# EAGLE design v5_compact (EAGLE 7.7.0)
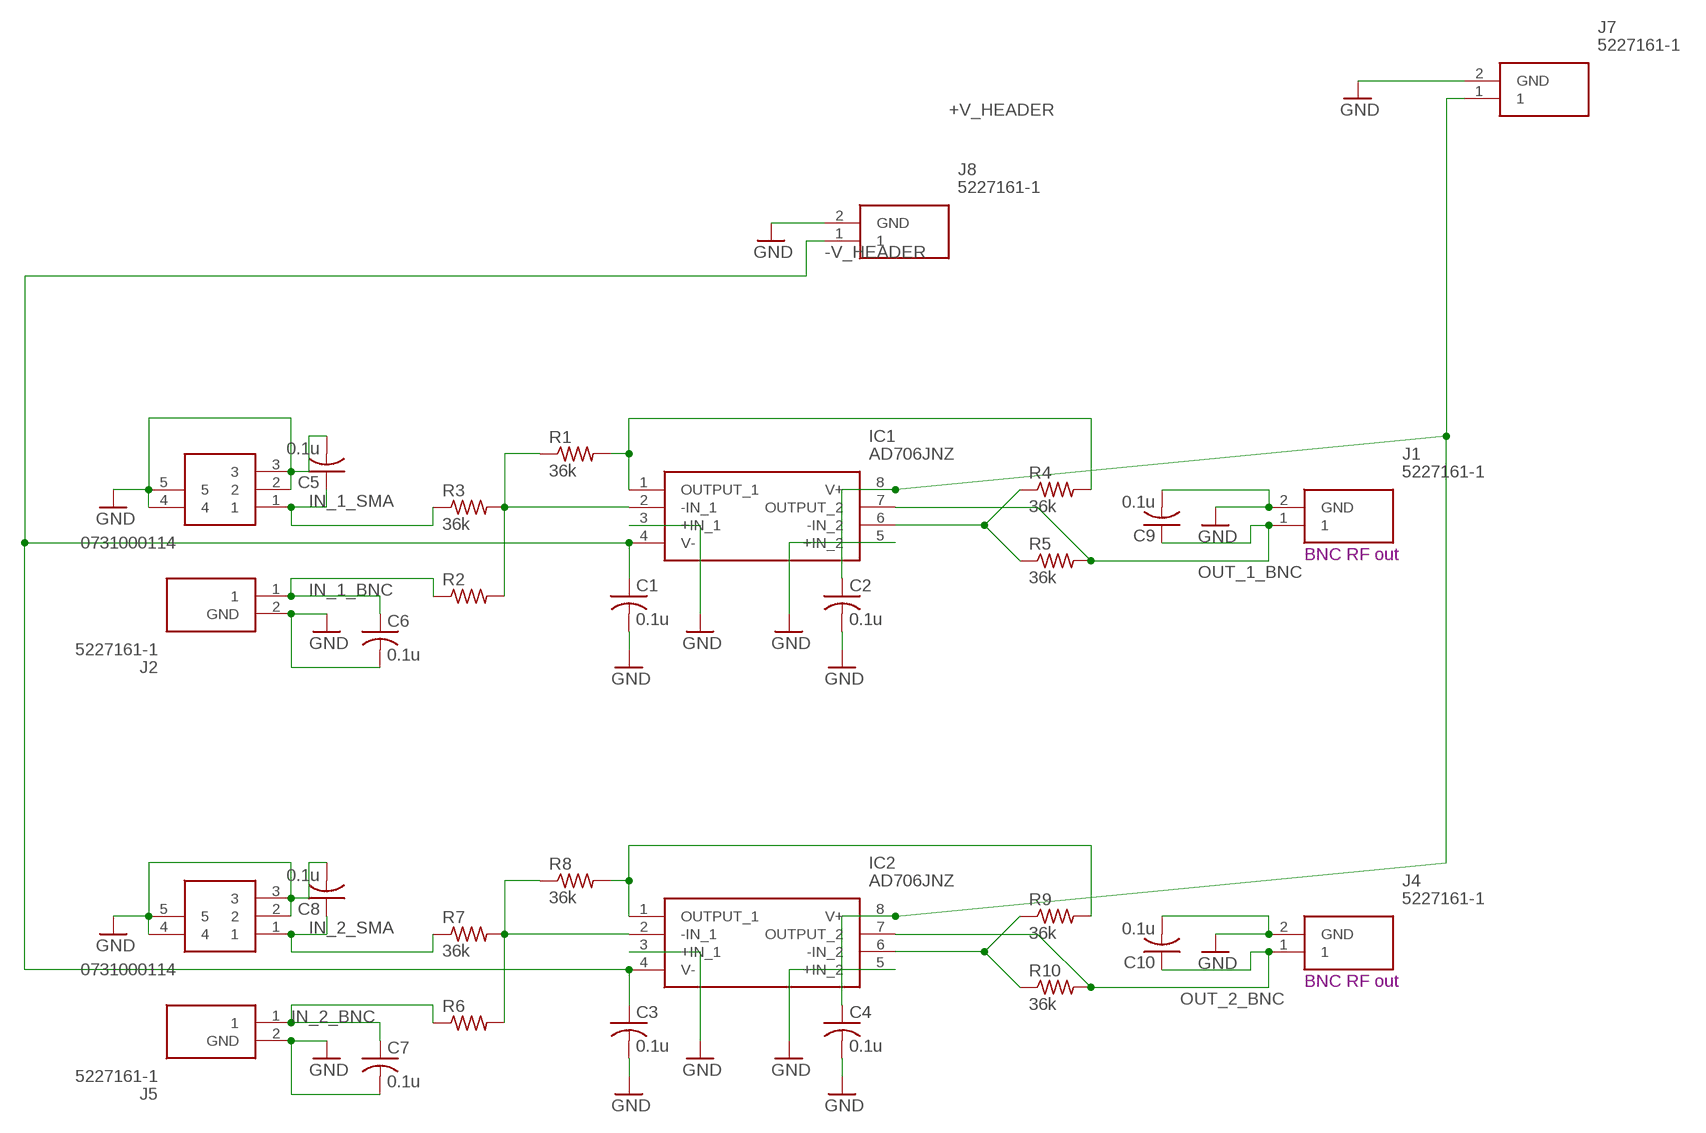
[diagram p0: schematic, sheet 1]

## Parts
C1  0.1u  C-US050-025X075  [C050-025X075]
C2  0.1u  C-US050-025X075  [C050-025X075]
C3  0.1u  C-US050-025X075  [C050-025X075]
C4  0.1u  C-US050-025X075  [C050-025X075]
C5  0.1u  C-US050-025X075  [C050-025X075]
C6  0.1u  C-US050-025X075  [C050-025X075]
C7  0.1u  C-US050-025X075  [C050-025X075]
C8  0.1u  C-US050-025X075  [C050-025X075]
C9  0.1u  C-US050-025X075  [C050-025X075]
C10  0.1u  C-US050-025X075  [C050-025X075]
IC1  AD706JNZ  [DIP794W56P254L959H533Q8N]
IC2  AD706JNZ  [DIP794W56P254L959H533Q8N]
J1  5227161-1  [52271611]
J2  5227161-1  [52271611]
J3  0731000114  [0731000114]
J4  5227161-1  [52271611]
J5  5227161-1  [52271611]
J6  0731000114  [0731000114]
J7  5227161-1  [52271611]
J8  5227161-1  [52271611]
R1  36k  R-US_0207/10  [0207/10]
R2  R-US_0207/10  [0207/10]
R3  36k  R-US_0207/10  [0207/10]
R4  36k  R-US_0207/10  [0207/10]
R5  36k  R-US_0207/10  [0207/10]
R6  R-US_0207/10  [0207/10]
R7  36k  R-US_0207/10  [0207/10]
R8  36k  R-US_0207/10  [0207/10]
R9  36k  R-US_0207/10  [0207/10]
R10  36k  R-US_0207/10  [0207/10]

## Nets
+V_HEADER: C2.1 C4.1 IC1.8(V+) IC2.8(V+) J7.1
-V_HEADER: C1.1 C3.1 IC1.4(V-) IC2.4(V-) J8.1
GND: C1.2 C2.2 C3.2 C4.2 C5.2 C6.2 C7.2 C8.2 C9.2 C10.2 IC1.3(+IN_1) IC1.5(+IN_2) IC2.3(+IN_1) IC2.5(+IN_2) J1.2(GND) J2.2(GND) J3.2 J3.3 J3.4 J3.5 J4.2(GND) J5.2(GND) J6.2 J6.3 J6.4 J6.5 J7.2(GND) J8.2(GND)
IN_1_BNC: C6.1 J2.1 R2.1
IN_1_SMA: C5.1 J3.1 R3.1
IN_2_BNC: C7.1 J5.1 R6.1
IN_2_SMA: C8.1 J6.1 R7.1
N$5: IC1.2(-IN_1) R1.1 R2.2 R3.2
N$8: IC1.1(OUTPUT_1) R1.2 R4.2
N$9: IC1.6(-IN_2) R4.1 R5.1
N$13: IC2.2(-IN_1) R6.2 R7.2 R8.1
N$14: IC2.6(-IN_2) R9.1 R10.1
N$17: IC2.1(OUTPUT_1) R8.2 R9.2
OUT_1_BNC: C9.1 IC1.7(OUTPUT_2) J1.1 R5.2
OUT_2_BNC: C10.1 IC2.7(OUTPUT_2) J4.1 R10.2

## Notes on the sheet
- BNC RF out
- BNC RF out

## Library data of the parts
C1-C10 = rcl:C-US: CAPACITOR, American symbol; SPICEPREFIX: C
IC1 IC2 = SamacSys_Parts:AD706JNZ: AD706JNZ, Dual Operational Amplifier, 8-Pin PDIP Source: Datasheet <https://www.analog.com/media/en/technical-documentation/data-sheets/AD706.pdf>; ARROW_PART_NUMBER: AD706JNZ; ARROW_PRICE-STOCK: https://www.arrow.com/en/products/ad706jnz/analog-devices?region=nac; DESCRIPTION: AD706JNZ, Dual Operational Amplifier, 8-Pin PDIP; HEIGHT: 5.33mm; MANUFACTURER_NAME: Analog Devices; MANUFACTURER_PART_NUMBER: AD706JNZ; MOUSER_PART_NUMBER: 584-AD706JNZ; MOUSER_PRICE-STOCK: https://www.mouser.co.uk/ProductDetail/Analog-Devices/AD706JNZ?qs=NmRFExCfTkFajf9zEDOFxg%3D%3D
J1 J2 J4 J5 J7 J8 = SamacSys_Parts:5227161-1: Body Features: Body Material Zinc | Body Plating Material Nickel | Configuration Features: Number of Positions 1 | Number of Coaxial Contacts 1 | PCB Mount Orientation Right Angle | Contact Features: RF Connector Center Contact Plating Thickness 5080 MICIN | RF Connector Center Contact Plating Material Tin | RF Connector Center Contact Material Phosphor Bronze | Dimensions: Profile Height from PCB 15.88 MM | Profile Height from PCB .625 INCH | RF Connector Mated Outer Diameter (Approximate) .572 INCH | Moun Source: Datasheet <https://www.te.com/commerce/DocumentDelivery/DDEController?Action=srchrtrv&DocNm=1307191_BNC_Connectors&DocType=Catalog Section&DocLang=English&PartCntxt=5227161-1&DocFormat=pdf>; ARROW_PART_NUMBER: 5227161-1; ARROW_PRICE-STOCK: https://www.arrow.com/en/products/5227161-1/te-connectivity?region=nac; DESCRIPTION: Body Features: Body Material Zinc | Body Plating Material Nickel | Configuration Features: Number of Positions 1 | Number of Coaxial Contacts 1 | PCB Mount Orientation Right Angle | Contact Features: RF Connector Center Contact Plating Thickness 5080 MICIN | RF Connector Center Contact Plating Material Tin | RF Connector Center Contact Material Phosphor Bronze | Dimensions: Profile Height from PCB 15.88 MM | Profile Height from PCB .625 INCH | RF Connector Mated Outer Diameter (Approximate) .572 INCH | Moun; HEIGHT: 16.13mm; MANUFACTURER_NAME: TE Connectivity; MANUFACTURER_PART_NUMBER: 5227161-1; MOUSER_PART_NUMBER: 571-5227161-1; MOUSER_PRICE-STOCK: https://www.mouser.co.uk/ProductDetail/TE-Connectivity/5227161-1?qs=GSeC4G%252BEqEUUGQ2MIkRn5w%3D%3D
J3 J6 = SamacSys_Parts:0731000114: Conn SMA 0Hz to 12GHz 50Ohm Solder RA Thru-Hole F Gold SMA Tray Source: Datasheet <https://www.molex.com/pdm_docs/sd/731000114_sd.pdf>; ARROW_PART_NUMBER: 0731000114; ARROW_PRICE-STOCK: https://www.arrow.com/en/products/0731000114/molex?region=europe; DESCRIPTION: Conn SMA 0Hz to 12GHz 50Ohm Solder RA Thru-Hole F Gold SMA Tray; HEIGHT: 9.57mm; MANUFACTURER_NAME: Molex; MANUFACTURER_PART_NUMBER: 0731000114; MOUSER_PART_NUMBER: N/A; MOUSER_PRICE-STOCK: https://www.mouser.co.uk/ProductDetail/Molex/0731000114?qs=PBcRNPEHKspjQWXqYv3LPw%3D%3D
R1-R10 = rcl:R-US_: RESISTOR, American symbol; SPICEPREFIX: R

## Board
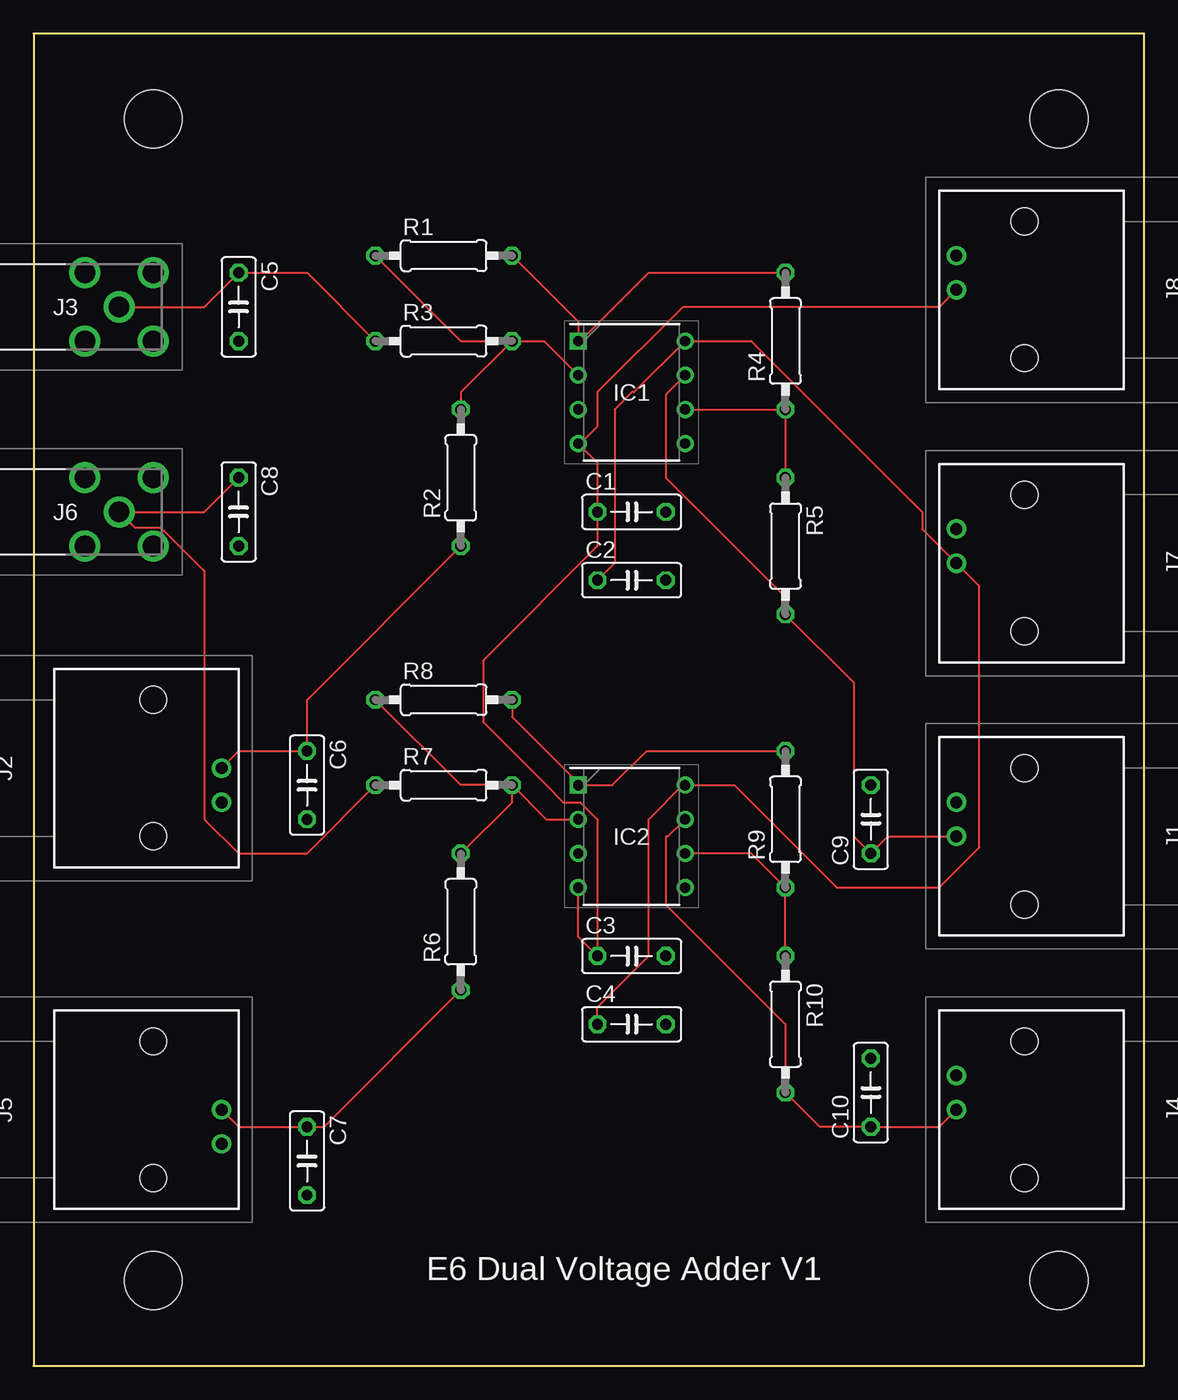
[diagram p1: board, top side]
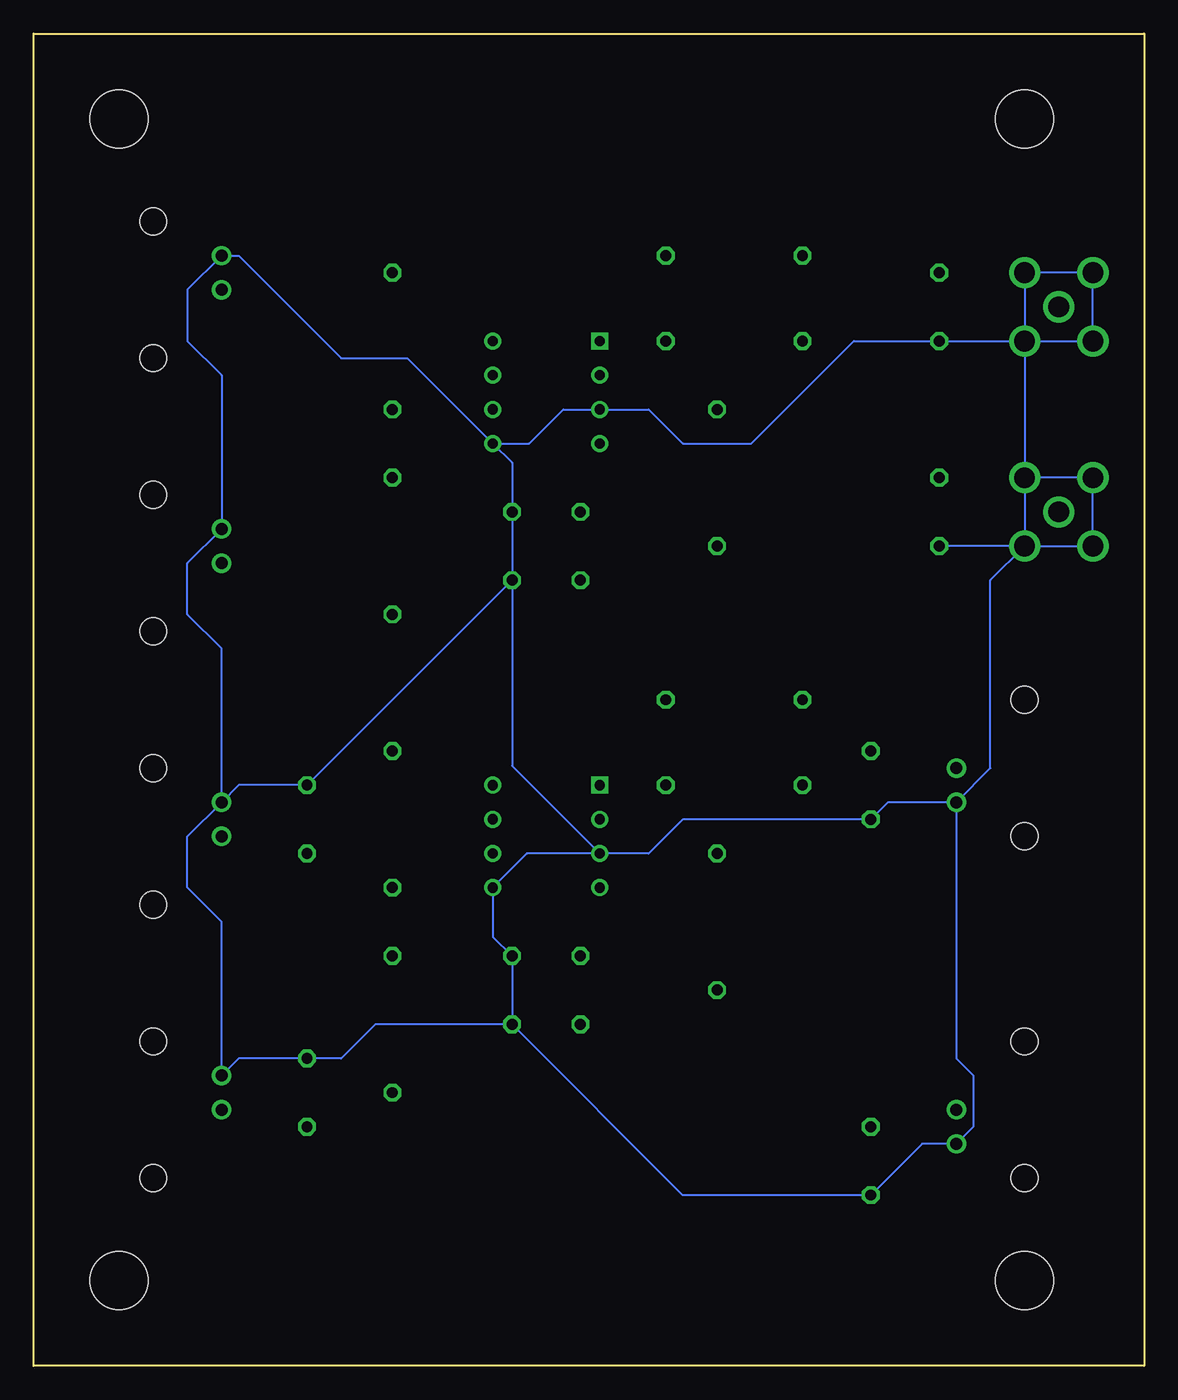
[diagram p2: board, bottom side, seen from below]

Size 82.55 x 99.06 mm. Coordinates in mm from the lower left corner, seen from the top.
Outline: 0,0 82.55,0 82.55,99.06 0,99.06 0,0
Copper layers (1*16): Top 0.035mm / dielectric 1.5mm / Bottom 0.035mm
Design rules "default": minimum track width 6mil, minimum drill 0.35mm, track to track 6mil, track to pad 6mil, pad to pad 6mil, via to via 6mil, smd to smd 6mil, copper to edge 40mil, drill to drill 6mil, minimum pad ring 10mil, minimum via ring 8mil, stop-mask expansion 4mil, vias tented up to drill 0mil, thermal gap 10mil
Holes 4.32 mm at 8.89,92.71 76.2,92.71 76.2,6.35 8.89,6.35

### Footprints (pad centres in the part's own frame; a part is rotated, then mirrored left to right if it is on the bottom)
C050-025X075 = drill 0.813 octagon: 1 -2.54,0; 2 2.54,0
DIP794W56P254L959H533Q8N = drill 0.76 pad 1.16 square: 1 -3.97,3.81 | drill 0.76 pad 1.16: 2 -3.97,1.27; 3 -3.97,-1.27; 4 -3.97,-3.81; 5 3.97,-3.81; 6 3.97,-1.27; 7 3.97,1.27; 8 3.97,3.81
52271611 = drill 0.89 pad 1.446: 1 2.54,0; 2 0,0 | hole 2.01: -2.54,5.08; 7.62,5.08
0731000114 = drill 1.54 pad 2.31: 1 0,0; 2 2.54,2.54; 3 -2.54,2.54; 4 -2.54,-2.54; 5 2.54,-2.54
0207/10 = drill 0.813 octagon: 1 -5.08,0; 2 5.08,0

### Placement (x,y rotation side)
C1  44.45,63.5 0 top
C2  44.45,58.42 0 top
C3  44.45,30.48 0 top
C4  44.45,25.4 0 top
C5  15.24,78.74 270 top
C6  20.32,43.18 270 top
C7  20.32,15.24 270 top
C8  15.24,63.5 270 top
C9  62.23,40.64 90 top
C10  62.23,20.32 90 top
IC1  44.45,72.39 0 top
IC2  44.45,39.37 0 top
J1  68.58,41.91 270 top
J2  13.97,41.91 90 top
J3  6.35,78.74 0 top
J4  68.58,21.59 270 top
J5  13.97,16.51 90 top
J6  6.35,63.5 0 top
J7  68.58,62.23 270 top
J8  68.58,82.55 270 top
R1  30.48,82.55 0 top
R2  31.75,66.04 90 top
R3  30.48,76.2 0 top
R4  55.88,76.2 90 top
R5  55.88,60.96 270 top
R6  31.75,33.02 90 top
R7  30.48,43.18 0 top
R8  30.48,49.53 0 top
R9  55.88,40.64 90 top
R10  55.88,25.4 270 top

### Tracks (layer width: path | path; a pad name or v marks a point on that pad's centre or on a via)
+V_HEADER
  Top 0.152: C2.1 43.18,59.69 43.18,71.12 44.45,72.39 44.61,72.39 IC1.8 53.34,76.2 66.04,63.5 66.04,62.23 J7.1 70.29,57.98 70.29,38.54 67.31,35.56 59.69,35.56 52.07,43.18 IC2.8 48.26,43.18 45.72,40.64 45.72,30.48 41.91,26.67 C4.1
-V_HEADER
  Top 0.152: IC1.4 40.56,68.5 | 40.56,68.5 41.91,67.15 C1.1 41.91,60.95 33.4,52.44 33.4,47.89 38.1,43.19 38.1,43.18 39.37,41.91 40.64,41.91 41.91,40.64 C3.1 40.48,31.91 IC2.4 | J8.1 67.31,78.74 48.26,78.74 41.91,72.39 41.91,69.85 40.56,68.5
GND
  Bottom 0.152: J3.5 J3.2 J3.3 J3.4 J3.5 | J6.2 J6.3 J6.4 J6.5 | J6.2 J6.5 | J3.5 J6.2 | J2.2 11.43,44.45 11.43,58.42 J6.5 | J2.2 13.97,22.86 12.7,21.59 12.7,17.78 J5.2 16.51,16.51 C7.2 34.29,12.7 C4.2 | C4.2 57.15,25.4 59.69,22.86 C10.2 67.31,22.86 J4.2 68.58,33.02 71.12,35.56 71.12,39.37 J1.2 | J1.2 68.58,53.34 71.12,55.88 71.12,59.69 J7.2 68.58,73.66 71.12,76.2 71.12,80.01 J8.2 67.31,82.55 59.69,74.93 54.77,74.93 IC1.5 | IC1.5 45.72,68.58 43.18,71.12 IC1.3 36.83,71.12 34.29,68.58 29.21,68.58 21.59,76.2 C5.2 J3.5 | IC1.5 46.99,67.15 C1.2 C2.2 | C2.2 46.99,44.61 IC2.3 | IC2.3 45.88,38.1 IC2.5 48.42,31.91 C3.2 C4.2 | J6.5 C8.2 | J2.2 19.05,41.91 C6.2 34.29,40.64 36.83,38.1 IC2.3 | J1.2 67.31,43.18 C9.2 C2.2
IN_1_BNC
  Top 0.152: J2.1 15.24,45.72 C6.1 20.32,49.53 R2.1
IN_1_SMA
  Top 0.152: J3.1 12.7,78.74 C5.1 20.32,81.28 R3.1
IN_2_BNC
  Top 0.152: J5.1 15.24,17.78 C7.1 21.59,17.78 R6.1
IN_2_SMA
  Top 0.152: C8.1 12.7,63.5 J6.1 7.51,62.34 9.46,62.34 12.7,59.11 12.7,40.64 15.24,38.1 20.32,38.1 R7.1
N$5
  Top 0.152: R1.1 31.75,76.2 R3.2 | R3.2 37.94,76.2 IC1.2 | R3.2 31.75,72.39 R2.2
N$8
  Top 0.152: R1.2 40.48,77.63 IC1.1 40.64,76.2 45.72,81.28 R4.2
N$9
  Top 0.152: IC1.6 R4.1 R5.1
N$13
  Top 0.152: R6.2 35.56,41.91 R7.2 | R7.2 38.1,40.64 IC2.2 | R7.2 31.75,43.18 R8.1
N$14
  Top 0.152: R10.1 R9.1 53.34,38.1 IC2.6
N$17
  Top 0.152: R8.2 35.56,48.26 40.48,43.34 IC2.1 43.02,43.18 45.56,45.72 R9.2
OUT_1_BNC
  Top 0.152: J1.1 63.5,39.37 C9.1 60.96,39.37 60.96,50.8 R5.2 55.88,57.15 46.99,66.04 46.99,72.23 IC1.7
OUT_2_BNC
  Top 0.152: J4.1 67.31,17.78 C10.1 58.42,17.78 R10.2 55.88,25.4 46.99,34.29 46.99,39.37 47.15,39.37 IC2.7

### Text on the board
tPlace: E6 Dual Voltage Adder V1